# Altium schematic sheet bms_BLOCKS_R00.SchDoc: Diagrama en Bloques
size A4; Author: Tobias Bavasso Piizzi; Revision: R00
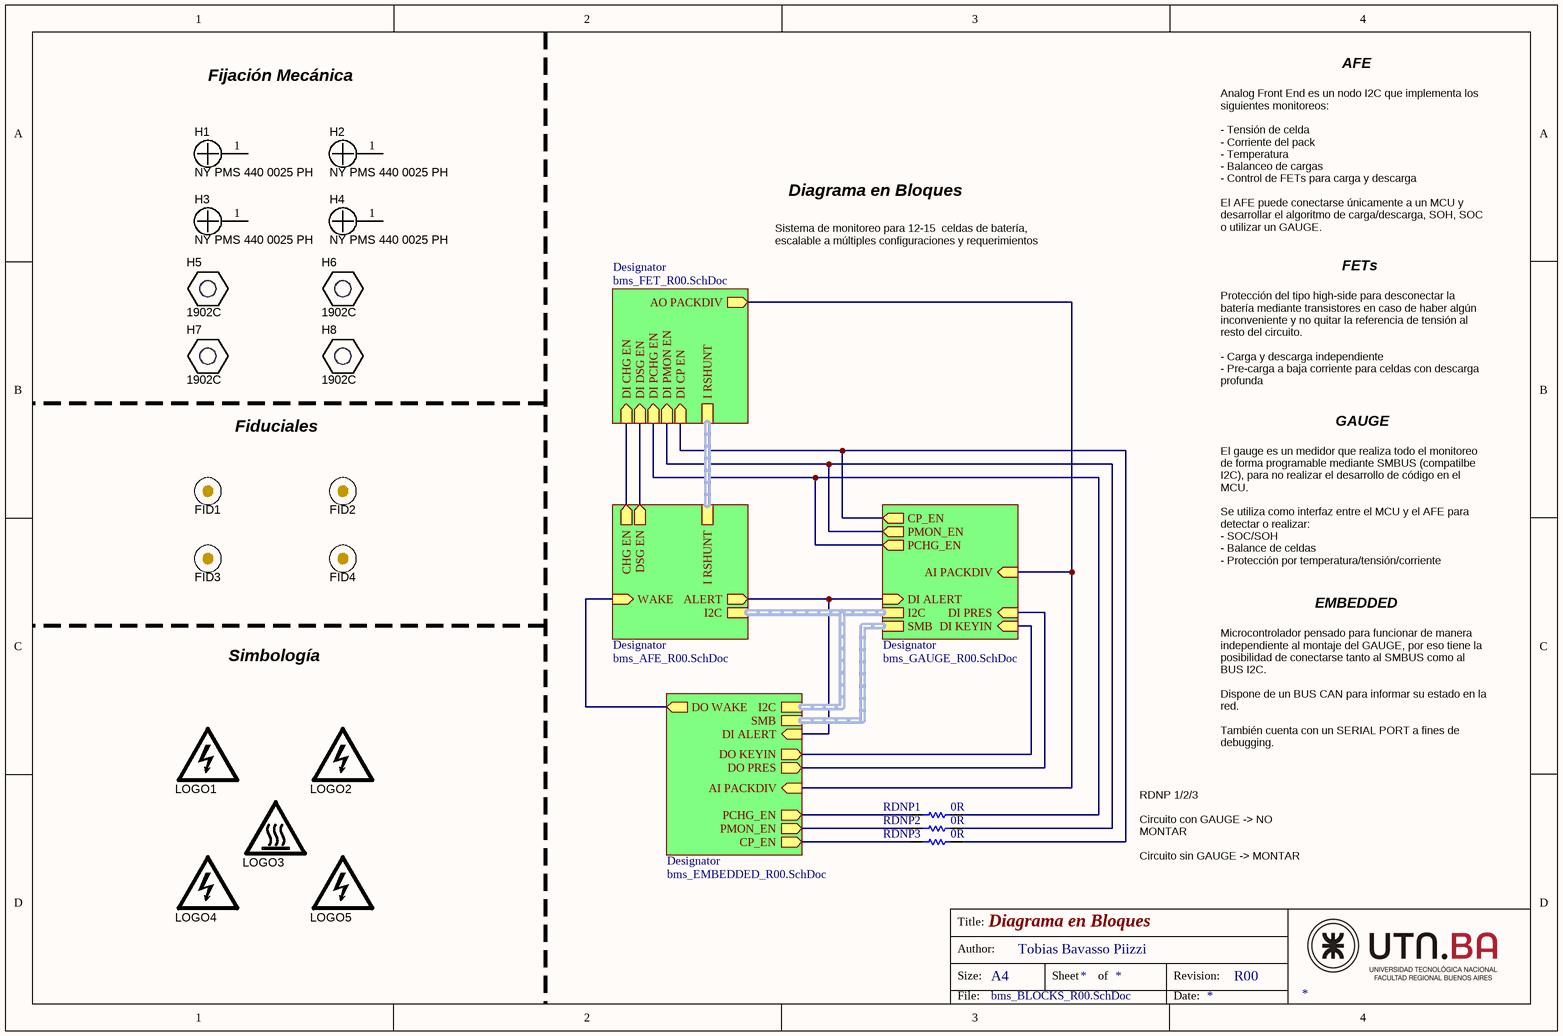
[diagram p0: bms_BLOCKS_R00.SchDoc]

## Parts
FID1  Fiducial  [Fiducial10-20]  (value not drawn)
FID2  Fiducial  [Fiducial10-20]  (value not drawn)
FID3  Fiducial  [Fiducial10-20]  (value not drawn)
FID4  Fiducial  [Fiducial10-20]  (value not drawn)
H1  NY PMS 440 0025 PH  [NY PMS 440 0025 PH]
H2  NY PMS 440 0025 PH  [NY PMS 440 0025 PH]
H3  NY PMS 440 0025 PH  [NY PMS 440 0025 PH]
H4  NY PMS 440 0025 PH  [NY PMS 440 0025 PH]
H5  1902C  [Keystone_1902C]
H6  1902C  [Keystone_1902C]
H7  1902C  [Keystone_1902C]
H8  1902C  [Keystone_1902C]
LOGO1  DANGER HIGH VOLTAGE  [IEC_HighVoltage_Small]  (value not drawn)  (no BOM)
LOGO2  DANGER HIGH VOLTAGE  [IEC_HighVoltage_Small]  (value not drawn)  (no BOM)
LOGO3  CAUTION HOT SURFACE  [IEC_HotSurface_Small]  (value not drawn)  (no BOM)
LOGO4  DANGER HIGH VOLTAGE  [IEC_HighVoltage_Small]  (value not drawn)  (no BOM)
LOGO5  DANGER HIGH VOLTAGE  [IEC_HighVoltage_Small]  (value not drawn)  (no BOM)
RDNP1  0R  [R0603]
RDNP2  0R  [R0603]
RDNP3  0R  [R0603]

## Sub-sheets
Designator = bms_FET_R00.SchDoc: DI CHG EN (in), DI PMON EN (in), DI PCHG EN (in), I RSHUNT (harness I Sense), DI DSG EN (in), DI CP EN (in), AO PACKDIV (out)
Designator = bms_AFE_R00.SchDoc: I2C (harness I2C), CHG EN (out), DSG EN (out), ALERT (out), I RSHUNT (harness I Sense), WAKE (in)
Designator = bms_GAUGE_R00.SchDoc: PMON_EN (out), PCHG_EN (out), CP_EN (out), AI PACKDIV (in), DI ALERT (in), DI KEYIN (in), DI PRES (in), SMB (harness SMBus), I2C (harness I2C)
Designator = bms_EMBEDDED_R00.SchDoc: AI PACKDIV (in), DI ALERT (in), DO WAKE (out), PCHG_EN (out), I2C (harness I2C), SMB (harness SMBus), CP_EN (out), PMON_EN (out), DO PRES (out), DO KEYIN (out)

## Nets
NetRDNP1_1: RDNP1.1 ; sheet Designator/PCHG_EN
NetRDNP1_2: RDNP1.2 ; sheet Designator/DI PCHG EN, sheet Designator/PCHG_EN
NetRDNP2_1: RDNP2.1 ; sheet Designator/PMON_EN
NetRDNP2_2: RDNP2.2 ; sheet Designator/DI PMON EN, sheet Designator/PMON_EN
NetRDNP3_1: RDNP3.1 ; sheet Designator/CP_EN
NetRDNP3_2: RDNP3.2 ; sheet Designator/DI CP EN, sheet Designator/CP_EN
(unnamed): sheet Designator/DI CHG EN, sheet Designator/CHG EN
(unnamed): sheet Designator/DI DSG EN, sheet Designator/DSG EN
(unnamed): sheet Designator/AO PACKDIV, sheet Designator/AI PACKDIV, sheet Designator/AI PACKDIV
(unnamed): sheet Designator/ALERT, sheet Designator/DI ALERT, sheet Designator/DI ALERT
(unnamed): sheet Designator/WAKE, sheet Designator/DO WAKE
(unnamed): sheet Designator/DI KEYIN, sheet Designator/DO KEYIN
(unnamed): sheet Designator/DI PRES, sheet Designator/DO PRES

Not connected (* = marked no-connect by the designer): H1 1; H2 1; H3 1; H4 1

## Notes on the sheet
- Fijación Mecánica
- AFE
- Diagrama en Bloques
- Analog Front End es un nodo I2C que implementa los siguientes monitoreos:
  - Tensión de celda
  - Corriente del pack
  - Temperatura
  - Balanceo de cargas
  - Control de FETs para carga y descarga
  El AFE puede conectarse únicamente a un MCU y desarrollar el algoritmo de carga/descarga, SOH, SOC o utilizar un GAUGE.
- Sistema de monitoreo para 12-15  celdas de batería, escalable a múltiples configuraciones y requerimientos
- FETs
- Fiduciales
- Protección del tipo high-side para desconectar la batería mediante transistores en caso de haber algún inconveniente y no quitar la referencia de tensión al resto del circuito.
  - Carga y descarga independiente
  - Pre-carga a baja corriente para celdas con descarga profunda
- GAUGE
- El gauge es un medidor que realiza todo el monitoreo de forma programable mediante SMBUS (compatilbe I2C), para no realizar el desarrollo de código en el MCU.
  Se utiliza como interfaz entre el MCU y el AFE para detectar o realizar:
  - SOC/SOH
  - Balance de celdas
  - Protección por temperatura/tensión/corriente
- EMBEDDED
- Simbología
- Microcontrolador pensado para funcionar de manera independiente al montaje del GAUGE, por eso tiene la posibilidad de conectarse tanto al SMBUS como al BUS I2C.
  Dispone de un BUS CAN para informar su estado en la red.
  También cuenta con un SERIAL PORT a fines de debugging.
- RDNP 1/2/3
  Circuito con GAUGE -> NO MONTAR
  Circuito sin GAUGE -> MONTAR
- Title:
- Size:
- Author:
- A4
- Sheet
- of
- Revision:
- File:
- Date:

## Library data of the parts
FID1-FID4 = Fiducial_1: Fiducial mark.  There is nothing to buy or mount.; SymbolCreator: codlsc; SymbolVersion: 2009-11-4; CompType: Fiducial; Publisher: Texas Instruments; LatestRevisionDate: 2014-08-01; LatestRevisionNote: Added Alternate PartNumber and Alternate Manufacturer parameters to appropriate components.; Manufacturer: N/A; MountType: N/A; PackageReference: Fiducial; PartNumber: N/A; ClassName: FiducialMark
H1-H4 = NY PMS 440 0025 PH: Machine Screw, Round, #4-40 x 1/4, Nylon, Philips panhead; Manufacturer: B&F Fastener Supply; CompType: Hardware; SymbolCreator: codlsc; U/M: EA; SymbolVersion: 2009-10-28; MountType: N/A; RoHS: Y; PartNumber: NY PMS 440 0025 PH; PackageReference: Screw; DigiKeyPartNumber: H542-ND; ComponentLink1Description: Datasheet Link; ComponentLink1URL: http://www.fasnetdirect.com/refguide/Nylpanms.pdf; ClassName: Mounting Holes; LatestRevisionDate: 2015-07-23; Publisher: Texas Instruments; Supplier 1: Digi-Key; Supplier Part Number 1: H542-ND
H5-H8 = 1902C: Standoff, Hex, 0.5"L #4-40 Nylon; Manufacturer: Keystone; CompType: Hardware; MountType: N/A; RoHS: Y; PartNumber: 1902C; PackageReference: Standoff; ComponentLink1Description: Datasheet Link; ComponentLink1URL: http://www.keyelco.com/pdfs/M55-prod31.pdf; Alternate Manufacturer: -; Alternate PartNumber: -; LatestRevisionDate: 2012-06-27; LatestRevisionNote: Initial Version; Publisher: Texas Instruments; Supplier 1: Digi-Key; Supplier Part Number 1: 1902CK-ND
LOGO1 LOGO2 LOGO4 LOGO5 = IEC_HighVoltage: IEC 61010-1 High Voltage Warning; SymbolCreator: a0412235; SymbolVersion: 2011-08-22; Published: 2009-03-03; Publisher: Texas Instruments; LatestRevisionDate: 2016-03-21
LOGO3 = IEC_HotSurface: IEC 61010-1 Hot Surface Warning; SymbolCreator: a0412235; SymbolVersion: 2011-08-22; Published: 2009-03-03; Publisher: Texas Instruments; LatestRevisionDate: 2016-03-21
RDNP1-RDNP3 = Res: Resistor